# Altium project MotherBoard.PrjPcb (part 3 of 3)

## Sheet PT100.SchDoc
size A4; SheetNumber: 1; SheetTotal: 16
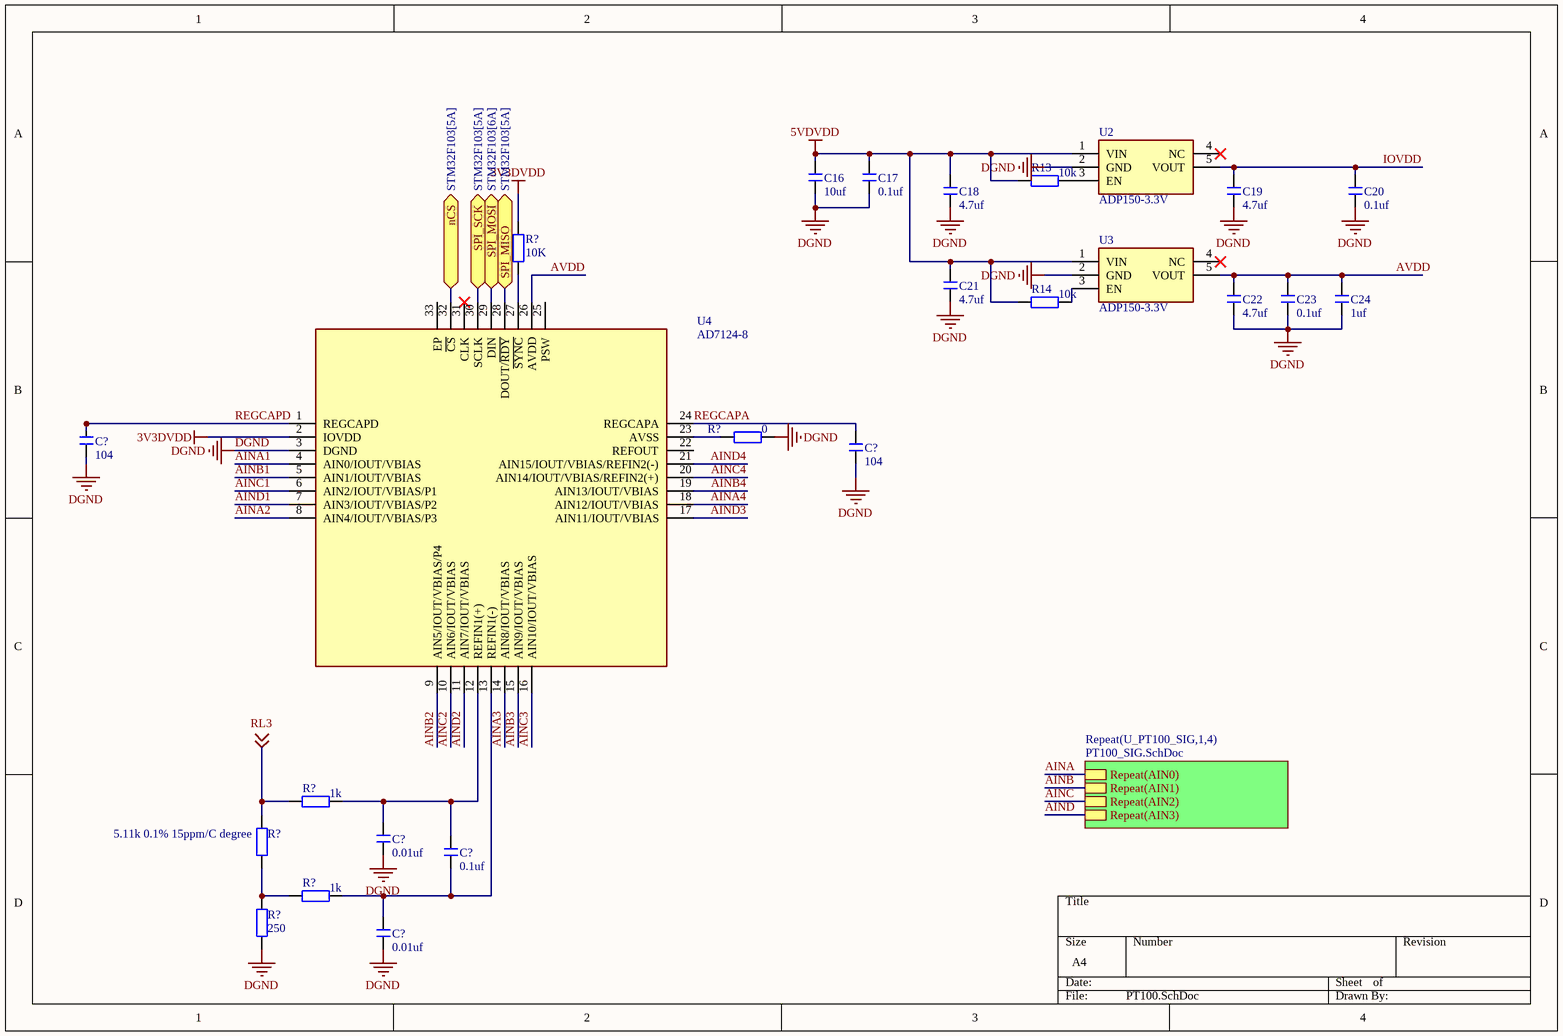
[diagram p14: PT100.SchDoc]

### Parts
(Parts that share a designator on the sheet are numbered #1, #2 ... from top to bottom, then left to right.)
C16  10uf  [C 0603_L]
C17  0.1uf  [C 0603_L]
C18  4.7uf  [C 0603_L]
C19  4.7uf  [C 0603_L]
C20  0.1uf  [C 0603_L]
C21  4.7uf  [C 0603_L]
C22  4.7uf  [C 0603_L]
C23  0.1uf  [C 0603_L]
C24  1uf  [C 0603_L]
C?#117  104  [C 0603_L]
C?#118  104  [C 0603_L]
C?#119  0.01uf  [C 0603_L]
C?#120  0.1uf  [C 0603_L]
C?#121  0.01uf  [C 0603_L]
R13  10k  [R 0603_L]
R14  10k  [R 0603_L]
R?#124  10K  [R 0603_L]
R?#125  0  [R 0603_L]
R?#126  1k  [R 0603_L]
R?#127  5.11k 0.1% 15ppm/C degree  [R 0603_L]
R?#128  1k  [R 0603_L]
R?#129  250  [R 0603_L]
U2  ADP150-3.3V
U3  ADP150-3.3V
U4  AD7124-8

### Sub-sheets
Repeat(U_PT100_SIG,1,4) = PT100_SIG.SchDoc: Repeat(AIN0), Repeat(AIN1), Repeat(AIN2), Repeat(AIN3)

### Ports
nCS (bidir, see STM32F103[5A]), SPI_MISO (bidir, see STM32F103[5A]), SPI_MOSI (bidir, see STM32F103[6A]), SPI_SCK (bidir, see STM32F103[5A])

### Nets
3V3DVDD: R?#124.1 U4.2(IOVDD)
5VDVDD: C16.2 C17.2 C18.2 C21.2 R13.1 R14.1 U2.1(VIN) U3.1(VIN)
DGND: C16.1 C17.1 C18.1 C19.1 C20.1 C21.1 C22.1 C23.1 C24.1 C?#117.2 C?#118.2 C?#119.1 C?#121.1 R?#125.2 R?#129.1 U2.2(GND) U3.2(GND) U4.3(DGND)
AINA: sheet Repeat(U_PT100_SIG,1,4)/Repeat(AIN0)
AINA1: U4.4(AIN0/IOUT/VBIAS)
AINA2: U4.8(AIN4/IOUT/VBIAS/P3)
AINA3: U4.14(AIN8/IOUT/VBIAS)
AINA4: U4.18(AIN12/IOUT/VBIAS)
AINB: sheet Repeat(U_PT100_SIG,1,4)/Repeat(AIN1)
AINB1: U4.5(AIN1/IOUT/VBIAS)
AINB2: U4.9(AIN5/IOUT/VBIAS/P4)
AINB3: U4.15(AIN9/IOUT/VBIAS)
AINB4: U4.19(AIN13/IOUT/VBIAS)
AINC: sheet Repeat(U_PT100_SIG,1,4)/Repeat(AIN2)
AINC1: U4.6(AIN2/IOUT/VBIAS/P1)
AINC2: U4.10(AIN6/IOUT/VBIAS)
AINC3: U4.16(AIN10/IOUT/VBIAS)
AINC4: U4.20(AIN14/IOUT/VBIAS/REFIN2(+))
AIND: sheet Repeat(U_PT100_SIG,1,4)/Repeat(AIN3)
AIND1: U4.7(AIN3/IOUT/VBIAS/P2)
AIND2: U4.11(AIN7/IOUT/VBIAS)
AIND3: U4.17(AIN11/IOUT/VBIAS)
AIND4: U4.21(AIN15/IOUT/VBIAS/REFIN2(-))
AVDD: C22.2 C23.2 C24.2 U3.5(VOUT) U4.26(AVDD)
IOVDD: C19.2 C20.2 U2.5(VOUT)
PT100_nCS: U4.32(~{CS}) ; port nCS
REGCAPA: C?#118.1 U4.24(REGCAPA)
REGCAPD: C?#117.1 U4.1(REGCAPD)
RL3: R?#126.1 R?#127.2 ; off-sheet RL3
SPI_MISO: U4.28(DOUT/~{RDY}) ; port SPI_MISO
SPI_MOSI: U4.29(DIN) ; port SPI_MOSI
SPI_SCK: U4.30(SCLK) ; port SPI_SCK
NetC?#119_2: C?#119.2 C?#120.2 R?#126.2 U4.12(REFIN1(+))
NetC?#120_1: C?#120.1 C?#121.2 R?#128.2 U4.13(REFIN1(-))
NetR13_2: R13.2 U2.3(EN)
NetR14_2: R14.2 U3.3(EN)
NetR?#124_2: R?#124.2 U4.27(~{SYNC})
NetR?#125_1: R?#125.1 U4.23(AVSS)
NetR?#127_1: R?#127.1 R?#128.1 R?#129.2

Not connected (* = marked no-connect by the designer): U2 4(NC)*; U3 4(NC)*; U4 22(REFOUT) 25(PSW) 31(CLK)* 33(EP)

### Library data of the parts
C16-C24 C?#119-C?#121 = C: 贴片电容
C?#117 C?#118 = C: 贴片电容; BOM名称: 无极性贴片电容
R13 R14 R?#126-R?#128 = 0805 电阻: 贴片电阻 0805 电阻; ComponentLink1Description: 供应商链接; ComponentLink1URL: http://www.szlcsc.com/product/details_18165.html; Package: 0805; Supplier: LC; SuppliersPartNumber: C17477
R?#124 R?#125 = R: 贴片电阻; BOM名称: 贴片电阻
R?#129 = 0805 电阻: Reference buffer Headroom 贴片电阻 0805 电阻; ComponentLink1Description: 供应商链接; ComponentLink1URL: http://www.szlcsc.com/product/details_18165.html; Package: 0805; Supplier: LC; SuppliersPartNumber: C17477
U2 = ADP150: IOVDD needs 1.8V
U3 = ADP150: ACDD needs 3.3V

## Sheet PT100_SIG.SchDoc
size A4; SheetNumber: 2; SheetTotal: 10
Used 4 times, as channels U_STM32F103/U_PT100/U_PT100_SIG1, U_STM32F103/U_PT100/U_PT100_SIG2, U_STM32F103/U_PT100/U_PT100_SIG3, U_STM32F103/U_PT100/U_PT100_SIG4. Parts and nets are listed once, with the designators drawn on the sheet.
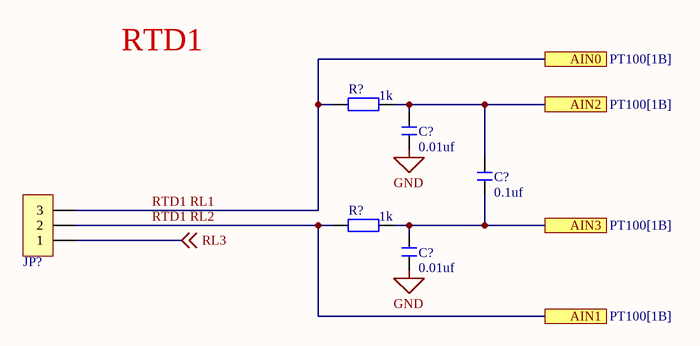
[diagram p15: PT100_SIG.SchDoc]

### Parts
(Parts that share a designator on the sheet are numbered #1, #2 ... from top to bottom, then left to right.)
C?#1  0.01uf  [C 0603_L]
C?#2  0.1uf  [C 0603_L]
C?#3  0.01uf  [C 0603_L]
JP?  HDR-1X3  [XH2.54-WI-3P]  (value not drawn)
R?#1  1k  [R 0603_L]
R?#2  1k  [R 0603_L]

### Ports
AIN0 (see PT100[1B]), AIN1 (see PT100[1B]), AIN2 (see PT100[1B]), AIN3 (see PT100[1B])

### Nets
GND: C?#1.1 C?#3.1
AIN2: C?#1.2 C?#2.2 R?#1.2 ; port AIN2
AIN3: C?#2.1 C?#3.2 R?#2.2 ; port AIN3
RL3: JP?.1 ; off-sheet RL3
RTD1 RL1: JP?.3 R?#1.1 ; port AIN0
RTD1 RL2: JP?.2 R?#2.1 ; port AIN1

### Channels
U_STM32F103/U_PT100/U_PT100_SIG1: designators C?=C?_U_PT100_SIG1#3 C?=C?_U_PT100_SIG1#1 C?=C?_U_PT100_SIG1#2 JP?=JP?_U_PT100_SIG1 R?=R?_U_PT100_SIG1#1 R?=R?_U_PT100_SIG1#2; ports AIN0=AINA1 AIN1=AINB1 AIN2=AINC1 AIN3=AIND1
U_STM32F103/U_PT100/U_PT100_SIG2: designators C?=C?_U_PT100_SIG2#3 C?=C?_U_PT100_SIG2#1 C?=C?_U_PT100_SIG2#2 JP?=JP?_U_PT100_SIG2 R?=R?_U_PT100_SIG2#1 R?=R?_U_PT100_SIG2#2; ports AIN0=AINA2 AIN1=AINB2 AIN2=AINC2 AIN3=AIND2
U_STM32F103/U_PT100/U_PT100_SIG3: designators C?=C?_U_PT100_SIG3#3 C?=C?_U_PT100_SIG3#1 C?=C?_U_PT100_SIG3#2 JP?=JP?_U_PT100_SIG3 R?=R?_U_PT100_SIG3#1 R?=R?_U_PT100_SIG3#2; ports AIN0=AINA3 AIN1=AINB3 AIN2=AINC3 AIN3=AIND3
U_STM32F103/U_PT100/U_PT100_SIG4: designators C?=C?_U_PT100_SIG4#3 C?=C?_U_PT100_SIG4#1 C?=C?_U_PT100_SIG4#2 JP?=JP?_U_PT100_SIG4 R?=R?_U_PT100_SIG4#1 R?=R?_U_PT100_SIG4#2; ports AIN0=AINA4 AIN1=AINB4 AIN2=AINC4 AIN3=AIND4

### Notes on the sheet
- RTD1

### Library data of the parts
C?#1-C?#3 = C: 贴片电容; BOM名称: 无极性贴片电容; 淘宝ID: 封装库来自淘宝 ID：黄晶宝石; 联系售后，技术支持: https://shop463601444.taobao.com; 唯一出售店铺网址: https://shop463601444.taobao.com
JP? = Header 3: 3P接插件; 版权归属: 封装库来自淘宝 ID：黄晶宝石; BOM名称: 3P接插件; 学习资源: https://shop463601444.taobao.com
R?#1 R?#2 = 0805 电阻: 贴片电阻 0805 电阻; ComponentLink1Description: 供应商链接; ComponentLink1URL: http://www.szlcsc.com/product/details_18165.html; Package: 0805; Supplier: LC; SuppliersPartNumber: C17477

## Nets that join several sheets
0V75DVDD: CPU_CONN1 (R?#1.7), STM32F103 (R?#101.6)
1V0DVDD: CPU_CONN1 (R?#1.6), STM32F103 (R?#101.7)
1V2DVDD: CPU_CONN1 (R?#1.5), STM32F103 (R?#101.8)
1V5DVDD: CPU_CONN1 (R?#2.7), STM32F103 (R?#100.6)
1V8DVDD: CPU_CONN1 (R?#2.6), STM32F103 (R?#100.7)
1V35DVDD: CPU_CONN1 (R?#2.8), STM32F103 (R?#100.5)
2V5DVDD: CPU_CONN1 (R?#3.8), STM32F103 (R?#100.8)
3V3DVDD: CPU_CONN1 (12 pins), CPLD (12 pins), MainPower (6 pins), DigiConn (7 pins), PowerBRDConn (5 pins), RK3399PRO-JD4 (U?#5.232), CODEC (C?#52.2 C?#53.2 C?#54.2 IC?#5.46), HDMI (7 pins), EthernetRTL8211 (R?#75.1 R?#76.1 R?#78.1 R?#79.1), USB_HUB (7 pins), STM32F103 (30 pins), STM32F1Debugger (16 pins), PT100 (R?#124.1 U4.2)
5VDVDD: CPU_CONN1 (R?#3.6), MainPower (CE?#3.1 FL?#3.3), DigiConn (J?#4.P7 J?#4.P8 J?#4.P9), PowerBRDConn (J?#5.P8 J?#6.P8), RK3399PRO-JD4 (6 pins), CODEC (IC?#5.2), HDMI (C?#55.2 C?#56.2 D?#29.1 J?#9.18), USB_HUB (R?#82.1 U?#16.7 U?#16.8), STM32F103 (C?#87.2 C?#88.2 R?#98.1 U?#19.2), PT100 (8 pins)
12V: DigiConn (J?#4.P13 J?#4.P14 J?#4.P15), PowerBRDConn (6 pins), STM32F103 (R?#96.1)
ARM_1V8DVDD: RK3399PRO-JD4 (U?#5.228 U?#5.229), CODEC (12 pins)
ARM_3V3DVDD: RK3399PRO-JD4 (9 pins), WIFI_BT (C?#34.1 C?#35.1 C?#36.1 U?#14.36)
ARM_3VDVDD: RK3399PRO-JD4 (U?#5.230 U?#5.231), CODEC (IC?#5.3)
ARM_USBDVDD: RK3399PRO-JD4 (J?#7.1 U?#4.1 USB?#2.1), USB_HUB (USB?#4.1 USB?#4.8 USB?#5.1 USB?#5.8)
ARM_VDDIO: RK3399PRO-JD4 (U?#5.224 U?#5.225), WIFI_BT (C?#37.1 C?#38.1 U?#14.34)
DGND: CPU_CONN1 (55 pins), CPLD (18 pins), MainPower (20 pins), DigiConn (15 pins), PowerBRDConn (14 pins), RK3399PRO-JD4 (65 pins), WIFI_BT (28 pins), CODEC (24 pins), HDMI (17 pins), EthernetRTL8211 (28 pins), USB_HUB (37 pins), STM32F103 (52 pins), STM32F1Debugger (30 pins), PT100 (18 pins)
DRAM_DVDD: CPU_CONN1 (R?#1.8), STM32F103 (R?#101.5)
GND: PowerBRDConn (J?#5.E6 J?#6.E6), RK3399PRO-JD4 (8 pins), U_STM32F103/U_PT100/U_PT100_SIG1 (C?_U_PT100_SIG1#1.1 C?_U_PT100_SIG1#3.1), U_STM32F103/U_PT100/U_PT100_SIG2 (C?_U_PT100_SIG2#1.1 C?_U_PT100_SIG2#3.1), U_STM32F103/U_PT100/U_PT100_SIG3 (C?_U_PT100_SIG3#1.1 C?_U_PT100_SIG3#3.1), U_STM32F103/U_PT100/U_PT100_SIG4 (C?_U_PT100_SIG4#1.1 C?_U_PT100_SIG4#3.1)
LAN_3V3: RK3399PRO-JD4 (U?#5.226 U?#5.227), EthernetRTL8211 (10 pins)
AINA1: PT100 (U4.4), U_STM32F103/U_PT100/U_PT100_SIG1 (JP?_U_PT100_SIG1.3 R?_U_PT100_SIG1#1.1)
AINA2: PT100 (U4.8), U_STM32F103/U_PT100/U_PT100_SIG2 (JP?_U_PT100_SIG2.3 R?_U_PT100_SIG2#1.1)
AINA3: PT100 (U4.14), U_STM32F103/U_PT100/U_PT100_SIG3 (JP?_U_PT100_SIG3.3 R?_U_PT100_SIG3#1.1)
AINA4: PT100 (U4.18), U_STM32F103/U_PT100/U_PT100_SIG4 (JP?_U_PT100_SIG4.3 R?_U_PT100_SIG4#1.1)
AINB1: PT100 (U4.5), U_STM32F103/U_PT100/U_PT100_SIG1 (JP?_U_PT100_SIG1.2 R?_U_PT100_SIG1#2.1)
AINB2: PT100 (U4.9), U_STM32F103/U_PT100/U_PT100_SIG2 (JP?_U_PT100_SIG2.2 R?_U_PT100_SIG2#2.1)
AINB3: PT100 (U4.15), U_STM32F103/U_PT100/U_PT100_SIG3 (JP?_U_PT100_SIG3.2 R?_U_PT100_SIG3#2.1)
AINB4: PT100 (U4.19), U_STM32F103/U_PT100/U_PT100_SIG4 (JP?_U_PT100_SIG4.2 R?_U_PT100_SIG4#2.1)
AINC1: PT100 (U4.6), U_STM32F103/U_PT100/U_PT100_SIG1 (C?_U_PT100_SIG1#1.2 C?_U_PT100_SIG1#2.2 R?_U_PT100_SIG1#1.2)
AINC2: PT100 (U4.10), U_STM32F103/U_PT100/U_PT100_SIG2 (C?_U_PT100_SIG2#1.2 C?_U_PT100_SIG2#2.2 R?_U_PT100_SIG2#1.2)
AINC3: PT100 (U4.16), U_STM32F103/U_PT100/U_PT100_SIG3 (C?_U_PT100_SIG3#1.2 C?_U_PT100_SIG3#2.2 R?_U_PT100_SIG3#1.2)
AINC4: PT100 (U4.20), U_STM32F103/U_PT100/U_PT100_SIG4 (C?_U_PT100_SIG4#1.2 C?_U_PT100_SIG4#2.2 R?_U_PT100_SIG4#1.2)
AIND1: PT100 (U4.7), U_STM32F103/U_PT100/U_PT100_SIG1 (C?_U_PT100_SIG1#2.1 C?_U_PT100_SIG1#3.2 R?_U_PT100_SIG1#2.2)
AIND2: PT100 (U4.11), U_STM32F103/U_PT100/U_PT100_SIG2 (C?_U_PT100_SIG2#2.1 C?_U_PT100_SIG2#3.2 R?_U_PT100_SIG2#2.2)
AIND3: PT100 (U4.17), U_STM32F103/U_PT100/U_PT100_SIG3 (C?_U_PT100_SIG3#2.1 C?_U_PT100_SIG3#3.2 R?_U_PT100_SIG3#2.2)
AIND4: PT100 (U4.21), U_STM32F103/U_PT100/U_PT100_SIG4 (C?_U_PT100_SIG4#2.1 C?_U_PT100_SIG4#3.2 R?_U_PT100_SIG4#2.2)
GPIO0_B2_D_1.8V: RK3399PRO-JD4 (U?#7.42), WIFI_BT (U?#14.15)
HDMI_CEC: RK3399PRO-JD4 (U?#3.95), HDMI (Q?#16.2 R?#62.1)
HDMI_HPD: RK3399PRO-JD4 (U?#3.89), HDMI (D?#26.5 D?#26.6 J?#9.19)
HDMI_I2C3_SCL: RK3399PRO-JD4 (U?#3.93), HDMI (Q?#15.2 R?#60.1)
HDMI_I2C3_SDA: RK3399PRO-JD4 (U?#3.91), HDMI (Q?#17.2 R?#64.1)
HDMI_TCN: RK3399PRO-JD4 (U?#3.99), HDMI (D?#28.5 D?#28.6 J?#9.12)
HDMI_TCP: RK3399PRO-JD4 (U?#3.101), HDMI (D?#28.4 D?#28.7 J?#9.10)
HDMI_TX0_N: RK3399PRO-JD4 (U?#3.103), HDMI (D?#28.2 D?#28.9 J?#9.9)
HDMI_TX0_P: RK3399PRO-JD4 (U?#3.105), HDMI (D?#28.1 D?#28.10 J?#9.7)
HDMI_TX1_N: RK3399PRO-JD4 (U?#3.107), HDMI (D?#27.5 D?#27.6 J?#9.6)
HDMI_TX1_P: RK3399PRO-JD4 (U?#3.109), HDMI (D?#27.4 D?#27.7 J?#9.4)
HDMI_TX2_N: RK3399PRO-JD4 (U?#3.111), HDMI (D?#27.2 D?#27.9 J?#9.3)
HDMI_TX2_P: RK3399PRO-JD4 (U?#3.113), HDMI (D?#27.1 D?#27.10 J?#9.1)
I2C1_SCL: RK3399PRO-JD4 (U?#10.24), CODEC (IC?#5.38 R?#53.1)
I2C1_SDA: RK3399PRO-JD4 (U?#10.22), CODEC (IC?#5.39 R?#52.1)
I2S0_LRCK_RX: RK3399PRO-JD4 (U?#10.32), CODEC (R?#55.5)
I2S0_LRCK_TX: RK3399PRO-JD4 (U?#10.34), CODEC (R?#55.6)
I2S0_SCLK: RK3399PRO-JD4 (U?#10.30), CODEC (R?#55.7)
I2S0_SDI0: RK3399PRO-JD4 (U?#10.36), CODEC (R?#56.2)
I2S0_SDO0: RK3399PRO-JD4 (U?#10.38), CODEC (R?#57.2)
I2S_CLK: RK3399PRO-JD4 (U?#10.20), CODEC (R?#55.8)
MAC_CLK: RK3399PRO-JD4 (U?#7.192), EthernetRTL8211 (U?#15.46)
MAC_MDC: RK3399PRO-JD4 (U?#7.184), EthernetRTL8211 (U?#15.30)
MAC_MDIO: RK3399PRO-JD4 (U?#7.182), EthernetRTL8211 (R?#78.2 U?#15.31)
MAC_RXCLK: RK3399PRO-JD4 (U?#7.188), EthernetRTL8211 (R?#72.2)
MAC_RXD0: RK3399PRO-JD4 (U?#7.198), EthernetRTL8211 (R?#70.1)
MAC_RXD1: RK3399PRO-JD4 (U?#7.194), EthernetRTL8211 (R?#70.2)
MAC_RXD2: RK3399PRO-JD4 (U?#7.200), EthernetRTL8211 (R?#70.3)
MAC_RXD3: RK3399PRO-JD4 (U?#7.196), EthernetRTL8211 (R?#70.4)
MAC_RXDV: RK3399PRO-JD4 (U?#7.202), EthernetRTL8211 (R?#69.2)
MAC_TXCLK: RK3399PRO-JD4 (U?#7.186), EthernetRTL8211 (R?#73.2)
MAC_TXD0: RK3399PRO-JD4 (U?#7.204), EthernetRTL8211 (R?#74.1)
MAC_TXD1: RK3399PRO-JD4 (U?#7.210), EthernetRTL8211 (R?#74.2)
MAC_TXD2: RK3399PRO-JD4 (U?#7.206), EthernetRTL8211 (R?#74.3)
MAC_TXD3: RK3399PRO-JD4 (U?#7.208), EthernetRTL8211 (R?#74.4)
MAC_TXEN: RK3399PRO-JD4 (U?#7.212), EthernetRTL8211 (U?#15.27)
PHY_RST: RK3399PRO-JD4 (U?#13.216), EthernetRTL8211 (R?#75.2 U?#15.29)
PMUIO2_VOLSEL: RK3399PRO-JD4 (U?#7.62), WIFI_BT (U?#14.38)
PT100_nCS: STM32F103 (U?#20.139), PT100 (U4.32)
RTC_CLKO_WIFI: RK3399PRO-JD4 (U?#7.60), WIFI_BT (U?#14.31)
SDIO0_CLKOUT: RK3399PRO-JD4 (U?#7.52), WIFI_BT (R?#48.2)
SDIO0_CMD: RK3399PRO-JD4 (U?#7.50), WIFI_BT (R?#48.1)
SDIO0_D0: RK3399PRO-JD4 (U?#7.54), WIFI_BT (R?#49.1)
SDIO0_D1: RK3399PRO-JD4 (U?#7.56), WIFI_BT (R?#51.1)
SDIO0_D2: RK3399PRO-JD4 (U?#7.46), WIFI_BT (R?#48.4)
SDIO0_D3: RK3399PRO-JD4 (U?#7.48), WIFI_BT (R?#48.3)
SDIO0_DETN: RK3399PRO-JD4 (U?#7.72), WIFI_BT (U?#14.49)
SDIO0_INTN: RK3399PRO-JD4 (U?#7.74), WIFI_BT (U?#14.50)
SDIO0_WRPT: RK3399PRO-JD4 (U?#7.44), WIFI_BT (U?#14.16)
SPI_MISO: STM32F103 (U?#20.134), PT100 (U4.28)
SPI_MOSI: STM32F103 (U?#20.135), PT100 (U4.29)
SPI_SCK: STM32F103 (U?#20.133), PT100 (U4.30)
UART0_CTSN: RK3399PRO-JD4 (U?#7.68), WIFI_BT (U?#14.42)
UART0_RTSN: RK3399PRO-JD4 (U?#7.70), WIFI_BT (U?#14.43)
UART0_RX: RK3399PRO-JD4 (U?#7.64), WIFI_BT (U?#14.40)
UART0_TX: RK3399PRO-JD4 (U?#7.66), WIFI_BT (U?#14.41)